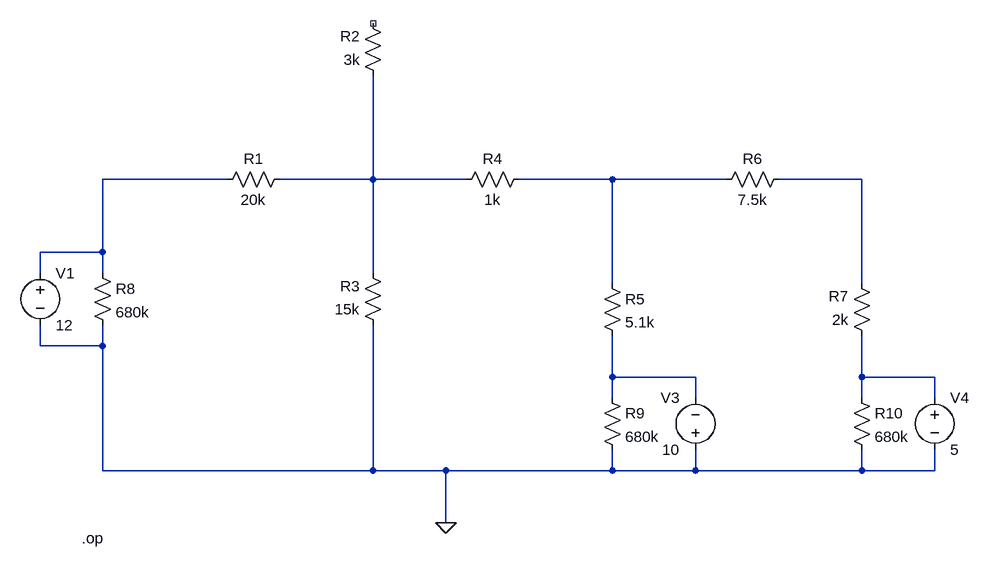
[diagram p0: schematic three-voltage-sources-ex.asc]
three-voltage-sources-ex.asc, the LTspice schematic file:
Version 4.1
SHEET 1 1240 680
WIRE 96 112 -96 112
WIRE 320 112 320 -48
WIRE 320 112 176 112
WIRE 464 112 320 112
WIRE 688 112 544 112
WIRE 864 112 688 112
WIRE 1072 112 944 112
WIRE -96 224 -96 112
WIRE -96 224 -192 224
WIRE -192 256 -192 224
WIRE -96 256 -96 224
WIRE 320 256 320 112
WIRE 688 272 688 112
WIRE 1072 272 1072 112
WIRE -192 368 -192 336
WIRE -96 368 -96 336
WIRE -96 368 -192 368
WIRE 688 416 688 352
WIRE 816 416 688 416
WIRE 1072 416 1072 352
WIRE 1184 416 1072 416
WIRE 688 448 688 416
WIRE 816 448 816 416
WIRE 1072 448 1072 416
WIRE 1184 448 1184 416
WIRE -96 560 -96 368
WIRE 320 560 320 336
WIRE 320 560 -96 560
WIRE 432 560 320 560
WIRE 688 560 688 528
WIRE 688 560 432 560
WIRE 816 560 816 528
WIRE 816 560 688 560
WIRE 1072 560 1072 528
WIRE 1072 560 816 560
WIRE 1184 560 1184 528
WIRE 1184 560 1072 560
WIRE 432 640 432 560
FLAG 432 640 0
SYMBOL res 192 96 R90
WINDOW 0 0 56 VBottom 2
WINDOW 3 32 56 VTop 2
SYMATTR InstName R1
SYMATTR Value 20k
SYMBOL res 336 -32 R180
WINDOW 0 36 76 Left 2
WINDOW 3 36 40 Left 2
SYMATTR InstName R2
SYMATTR Value 3k
SYMBOL res 336 352 R180
WINDOW 0 36 76 Left 2
WINDOW 3 36 40 Left 2
SYMATTR InstName R3
SYMATTR Value 15k
SYMBOL res 448 128 R270
WINDOW 0 32 56 VTop 2
WINDOW 3 0 56 VBottom 2
SYMATTR InstName R4
SYMATTR Value 1k
SYMBOL res 672 256 R0
SYMATTR InstName R5
SYMATTR Value 5.1k
SYMBOL res 960 96 R90
WINDOW 0 0 56 VBottom 2
WINDOW 3 32 56 VTop 2
SYMATTR InstName R6
SYMATTR Value 7.5k
SYMBOL res 1088 368 R180
WINDOW 0 36 76 Left 2
WINDOW 3 36 40 Left 2
SYMATTR InstName R7
SYMATTR Value 2k
SYMBOL res -112 240 R0
SYMATTR InstName R8
SYMATTR Value 680k
SYMBOL res 672 432 R0
SYMATTR InstName R9
SYMATTR Value 680k
SYMBOL res 1056 432 R0
SYMATTR InstName R10
SYMATTR Value 680k
SYMBOL voltage -192 240 R0
WINDOW 123 0 0 Left 0
WINDOW 39 0 0 Left 0
SYMATTR InstName V1
SYMATTR Value 12
SYMBOL voltage 816 544 R180
WINDOW 0 24 96 Left 2
WINDOW 3 24 16 Left 2
WINDOW 123 0 0 Left 0
WINDOW 39 0 0 Left 0
SYMATTR InstName V3
SYMATTR Value 10
SYMBOL voltage 1184 432 R0
WINDOW 123 0 0 Left 0
WINDOW 39 0 0 Left 0
SYMATTR InstName V4
SYMATTR Value 5
TEXT -128 664 Left 2 !.op

The netlist it stands for:
* three-voltage-sources-ex.asc
R1 N002 N001 20k
R2 N002 NC_01 3k
R3 0 N002 15k
R4 N002 N003 1k
R5 N003 N005 5.1k
R6 N004 N003 7.5k
R7 N006 N004 2k
R8 N001 0 680k
R9 N005 0 680k
R10 N006 0 680k
V1 N001 0 12
V3 0 N005 10
V4 N006 0 5
.op
.backanno
.end